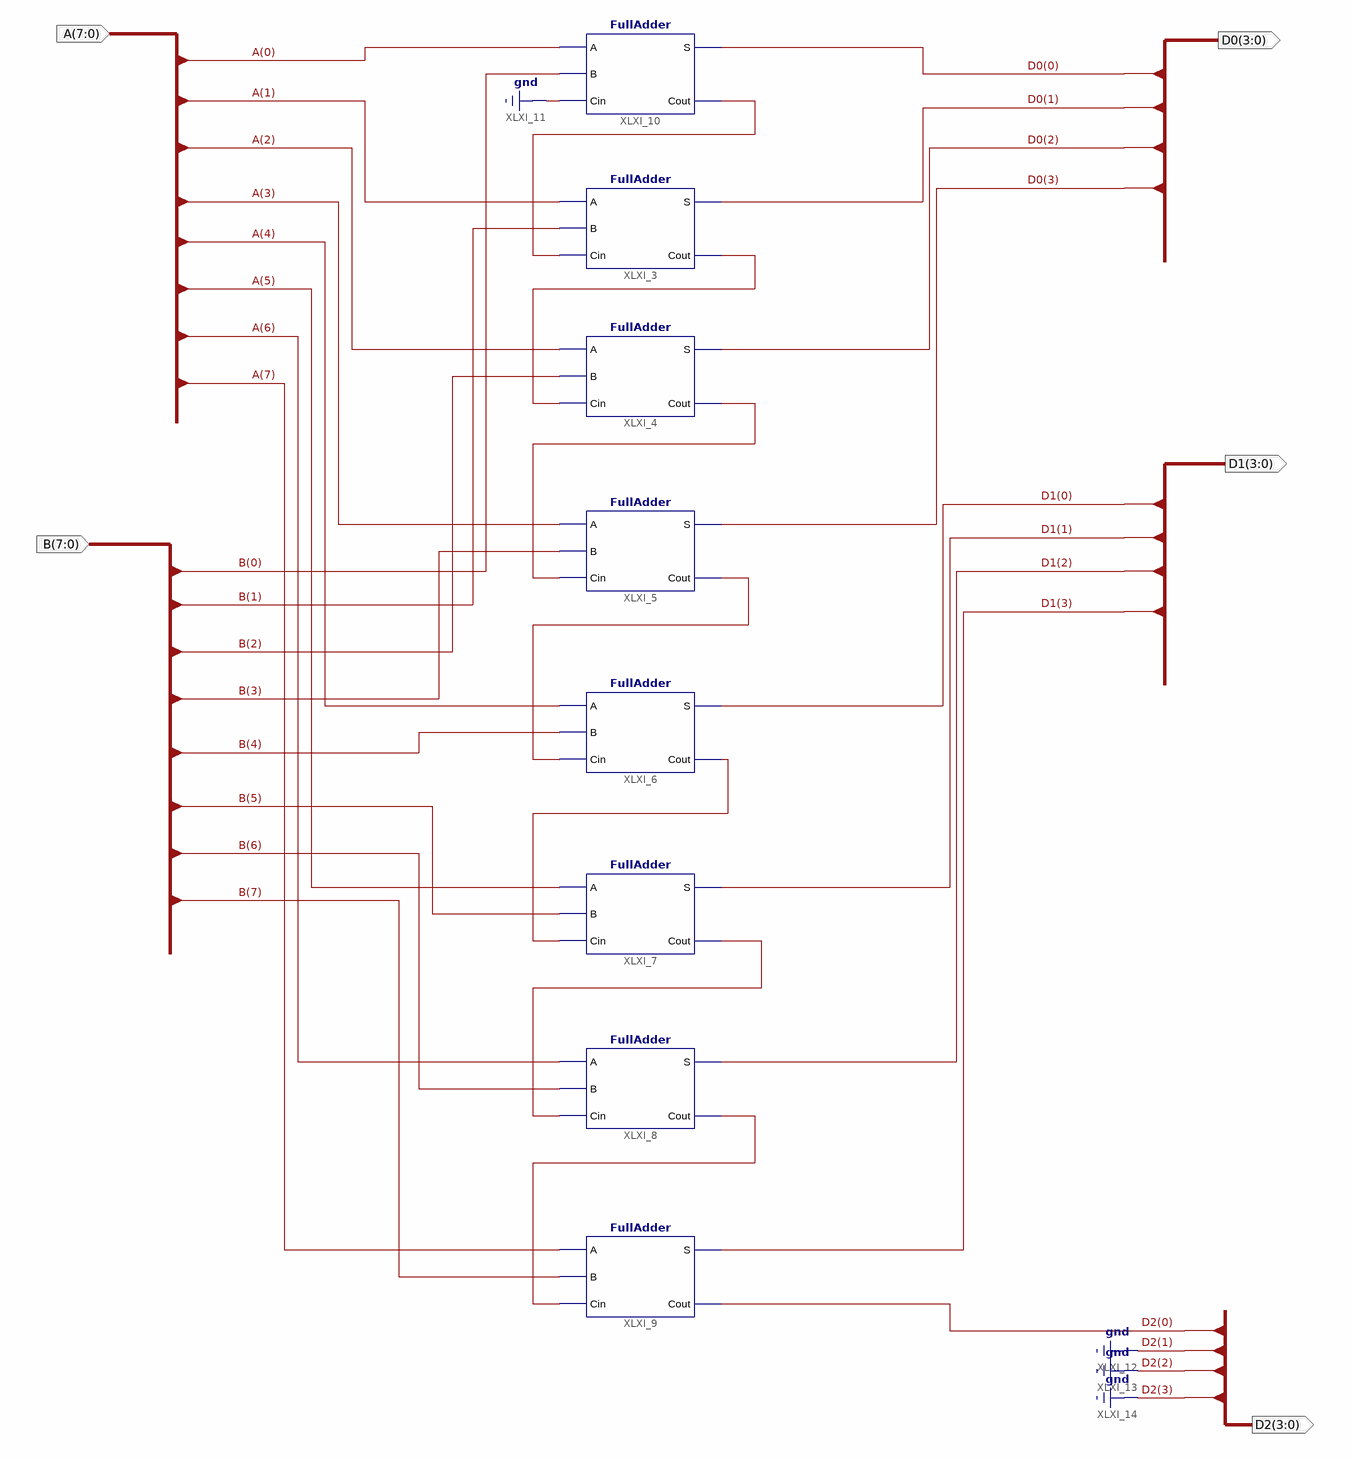
[diagram p0: schematic sheet 1]
// Xilinx ISE schematic FullAdder8bit.sch (spartan6) as structural Verilog: 8 symbols, 5 ports
module FullAdder8bit (
  input  [7:0] A,
  input  [7:0] B,
  output [3:0] D0,
  output [3:0] D1,
  output [3:0] D2
);

  wire XLXN_22, XLXN_23, XLXN_24, XLXN_26, XLXN_27, XLXN_28, XLXN_29;

  FullAdder XLXI_3 (.A(A[1]), .B(B[1]), .Cin(XLXN_22), .S(D0[1]), .Cout(XLXN_23));
  FullAdder XLXI_4 (.A(A[2]), .B(B[2]), .Cin(XLXN_23), .S(D0[2]), .Cout(XLXN_24));
  FullAdder XLXI_5 (.A(A[3]), .B(B[3]), .Cin(XLXN_24), .S(D0[3]), .Cout(XLXN_26));
  FullAdder XLXI_6 (.A(A[4]), .B(B[4]), .Cin(XLXN_26), .S(D1[0]), .Cout(XLXN_27));
  FullAdder XLXI_7 (.A(A[5]), .B(B[5]), .Cin(XLXN_27), .S(D1[1]), .Cout(XLXN_28));
  FullAdder XLXI_8 (.A(A[6]), .B(B[6]), .Cin(XLXN_28), .S(D1[2]), .Cout(XLXN_29));
  FullAdder XLXI_9 (.A(A[7]), .B(B[7]), .Cin(XLXN_29), .S(D1[3]), .Cout(D2[0]));
  FullAdder XLXI_10 (.A(A[0]), .B(B[0]), .Cin(1'b0), .S(D0[0]), .Cout(XLXN_22));

  assign D2[3:1] = 3'b000;
endmodule
